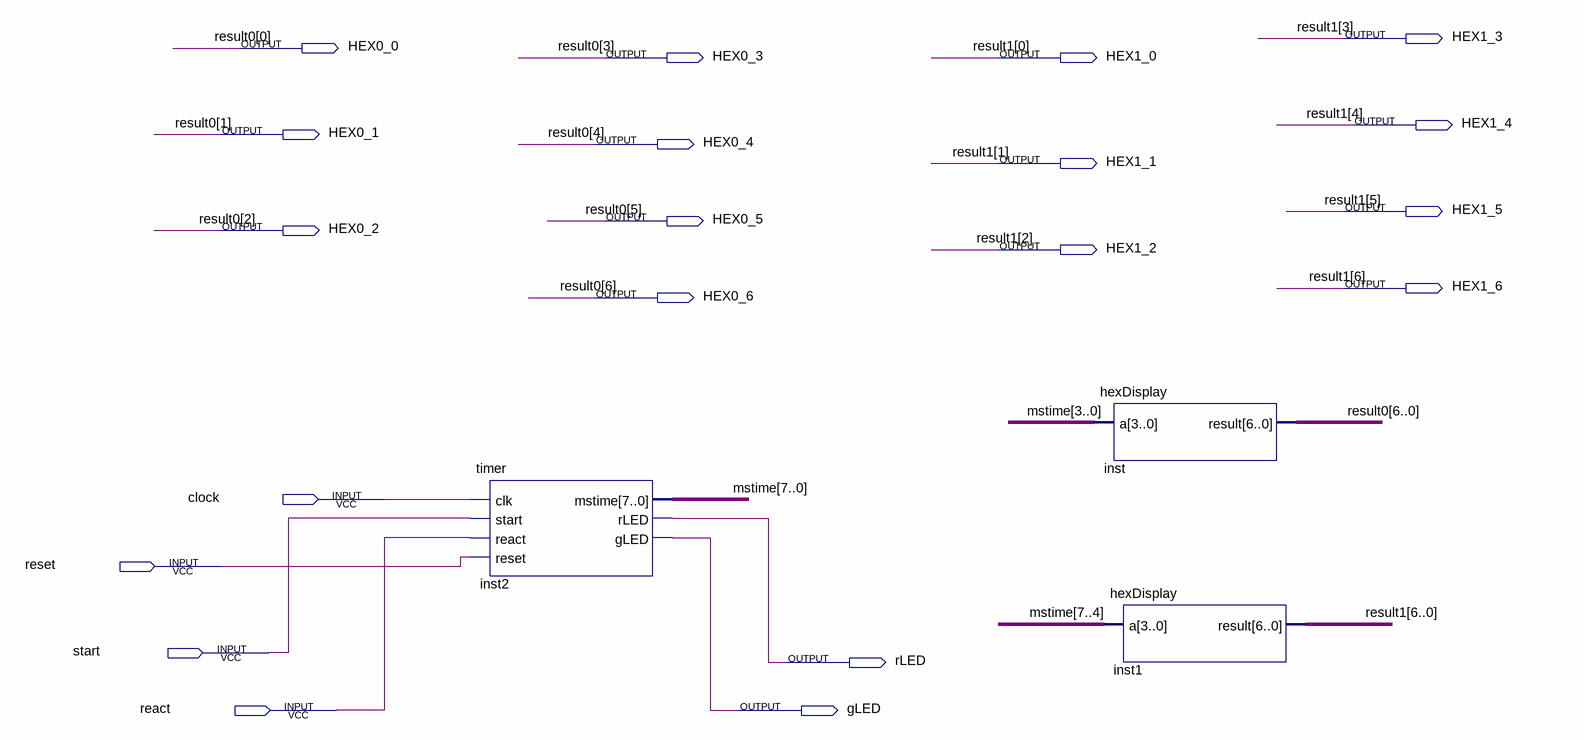
[diagram p0: schematic sheet]
// Quartus schematic reaction.bdf as structural Verilog: 3 symbols, 20 pins
module reaction (
  input  clock,
  input  reset,
  input  start,
  input  react,
  output HEX1_3,
  output HEX0_0,
  output HEX0_3,
  output HEX1_0,
  output HEX1_4,
  output HEX0_1,
  output HEX0_4,
  output HEX1_1,
  output HEX1_5,
  output HEX0_5,
  output HEX0_2,
  output HEX1_2,
  output HEX1_6,
  output HEX0_6,
  output rLED,
  output gLED
);

  wire [7:0] mstime;

  timer inst2 (.clk(clock), .start(start), .react(react), .reset(reset), .mstime(mstime), .rLED(rLED), .gLED(gLED));
  hexDisplay inst (.a(mstime[3:0]), .result({HEX0_6, HEX0_5, HEX0_4, HEX0_3, HEX0_2, HEX0_1, HEX0_0}));
  hexDisplay inst1 (.a(mstime[7:4]), .result({HEX1_6, HEX1_5, HEX1_4, HEX1_3, HEX1_2, HEX1_1, HEX1_0}));

  // Other names for the same wires on the sheet: result0[6:0] = {HEX0_6, HEX0_5, HEX0_4, HEX0_3, HEX0_2, HEX0_1, HEX0_0};
  //   result1[6:0] = {HEX1_6, HEX1_5, HEX1_4, HEX1_3, HEX1_2, HEX1_1, HEX1_0}
endmodule
